# Altium schematic sheet Li-ion_charger.SchDoc: Li-ion battery charger.
size 297 x 209 mm; Author: Dmitry Shpakov; Organization: NoName; Revision: Revision; SheetNumber: 5; SheetTotal: 5; PageSize: A4; ProjectName: Project Name
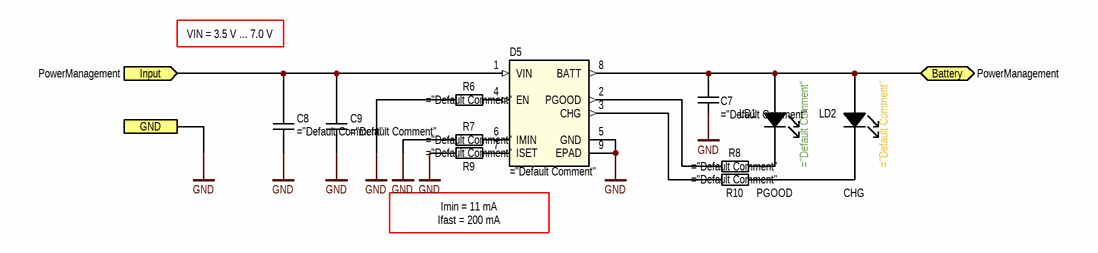
[diagram p0: Li-ion_charger.SchDoc]

## Parts
C7  (no value)
C8  (no value)
C9  (no value)
D5  (no value)
LD1  (no value)
LD2  (no value)
R6  (no value)
R7  (no value)
R8  (no value)
R9  (no value)
R10  (no value)

## Ports
Battery (bidir, see PowerManagement), GND (see PowerManagement, Buck_boost_converter, PowerManagement), Input (in, see PowerManagement)

## Nets
GND: C7.1 C8.2 C9.1 D5.5(GND) D5.9(EPAD) R6.1 R7.2 R9.1 ; port GND
Battery: C7.2 D5.8(BATT) LD1.C LD2.C ; port Battery
Input: C8.1 C9.2 D5.1(VIN) ; port Input
NetD5_2: D5.2(PGOOD) R8.1
NetD5_3: D5.3(CHG) R10.1
NetD5_4: D5.4(EN) R6.2
NetD5_6: D5.6(IMIN) R7.1
NetD5_7: D5.7(ISET) R9.2
NetLD1_A: LD1.A R8.2
NetLD2_A: LD2.A R10.2

## Notes on the sheet
- VIN = 3.5 V ... 7.0 V
- Imin = 11 mA
  Ifast = 200 mA
- PGOOD
- CHG
- Author
- Date
- Organization
- Page
- Total pages
- Materials
- Page size

## Library data of the parts
C7 C9 = CC0805KKX5R6BB105: CAP CER 1UF 10V X5R 0805; Manufacturer: YAGEO; Type: capacitor; Power Dissipation: * W; Rated Current: * A; Tolerance: 10 %; Other: 1 µF ±10% 10V Ceramic Capacitor X5R 0805 (2012 Metric); Operating Temperature: -55 °C to +85 °C; HelpURL: https://www.digikey.com/en/products/detail/yageo/CC0805KKX5R6BB105/2345239; Default Comment: 1 uF; Rated Voltage: 10 V; Rated Power: * W; Value: 1 uF; Summary: ="Type"+" "+"Part Number"+" "+"Manufacturer"+" "+"Value"+" "+"Tolerance"+" "+"Operating Temperature"+" "+"Case"+" "+"Power Dissipation"+" "+"Rated Current"+" "+"Rated Power"+" "+"Rated Voltage"+" "+"Other"; Assembly: *; Case: 0805; Part Number: CC0805KKX5R6BB105
C8 = CC0805KPX5R6BB106: CAP CER 10UF 10V X5R 0805; Manufacturer: YAGEO; Type: capacitor; Power Dissipation: * W; Rated Current: * A; Tolerance: 10 %; Other: 10 µF ±10% 10V Ceramic Capacitor X5R 0805 (2012 Metric); Operating Temperature: -55 °C to +85 °C; HelpURL: https://www.digikey.com/en/products/detail/yageo/CC0805KPX5R6BB106/11611309; Default Comment: 10 uF; Rated Voltage: 10 V; Rated Power: * W; Value: 10 uF; Summary: ="Type"+" "+"Part Number"+" "+"Manufacturer"+" "+"Value"+" "+"Tolerance"+" "+"Operating Temperature"+" "+"Case"+" "+"Power Dissipation"+" "+"Rated Current"+" "+"Rated Power"+" "+"Rated Voltage"+" "+"Other"; Assembly: *; Case: 0805; Part Number: CC0805KPX5R6BB106
D5 = RT9526AGQW: IC LI-ION BATT CHGR WDFN-8; Manufacturer: Richtek USA Inc.; Power Dissipation: * W; Rated Voltage: 28 V; Rated Current: * A; Tolerance: * %; Other: Charger IC Lithium Ion 8-WDFN (2x3); Operating Temperature: -40 °C to +85 °C; Type: ic; HelpURL: https://www.digikey.com/en/products/detail/richtek-usa-inc/RT9526AGQW/16376728; Default Comment: RT9526AGQW; Rated Power: * W; Value: *; Summary: ="Type"+" "+"Part Number"+" "+"Manufacturer"+" "+"Value"+" "+"Tolerance"+" "+"Operating Temperature"+" "+"Case"+" "+"Power Dissipation"+" "+"Rated Current"+" "+"Rated Power"+" "+"Rated Voltage"+" "+"Other"; Assembly: *; Case: 8-WDFN (2x3); Part Number: RT9526AGQW
LD1 = LTST-C191KGKT: LED GREEN CLEAR SMD; Manufacturer: Lite-On Inc.; Power Dissipation: * W; Tolerance: * %; Other: Green 571nm LED Indication - Discrete 2V 0603 (1608 Metric); Rated Voltage: 2 V; Rated Current: 20 mA; Operating Temperature: -55 °C to +85 °C; Type: led; HelpURL: https://www.digikey.com/en/products/detail/liteon/LTST-C191KGKT/386835; Default Comment: green; Rated Power: * W; Summary: ="Type"+" "+"Part Number"+" "+"Manufacturer"+" "+"Value"+" "+"Tolerance"+" "+"Operating Temperature"+" "+"Case"+" "+"Power Dissipation"+" "+"Rated Current"+" "+"Rated Power"+" "+"Rated Voltage"+" "+"Other"; Assembly: *; Case: 0603; Part Number: LTST-C191KGKT; Value: green
LD2 = LTST-C191KSKT: LED YELLOW CLEAR SMD; Manufacturer: Lite-On Inc.; Power Dissipation: * W; Tolerance: * %; Other: Yellow 591nm LED Indication - Discrete 2.1V 0603 (1608 Metric); Rated Voltage: 2.1 V; Rated Current: 20 mA; Operating Temperature: -55 °C to +85 °C; Type: led; HelpURL: https://www.digikey.com/en/products/detail/liteon/LTST-C191KSKT/386839; Default Comment: yellow; Rated Power: * W; Summary: ="Type"+" "+"Part Number"+" "+"Manufacturer"+" "+"Value"+" "+"Tolerance"+" "+"Operating Temperature"+" "+"Case"+" "+"Power Dissipation"+" "+"Rated Current"+" "+"Rated Power"+" "+"Rated Voltage"+" "+"Other"; Assembly: *; Case: 0603; Part Number: LTST-C191KSKT; Value: yellow
R6 = RC0603FR-07200KL: RES 200K OHM 1% 1/10W 0603; Manufacturer: YAGEO; Power Dissipation: 0.1 W; Rated Voltage: * V; Rated Current: * A; Other: 200 kOhms ±1% 0.1W, 1/10W Chip Resistor 0603 (1608 Metric) Moisture Resistant Thick Film; Operating Temperature: -55 °C to +155 °C; Type: resistor; HelpURL: https://www.digikey.com/en/products/detail/yageo/RC0603FR-07200KL/727044; Default Comment: 200k; Rated Power: 0.1 W; Tolerance: 1 %; Value: 200k; Summary: ="Type"+" "+"Part Number"+" "+"Manufacturer"+" "+"Value"+" "+"Tolerance"+" "+"Operating Temperature"+" "+"Case"+" "+"Power Dissipation"+" "+"Rated Current"+" "+"Rated Power"+" "+"Rated Voltage"+" "+"Other"; Assembly: *; Case: 0603; Part Number: RC0603FR-07200KL
R7 = RC0603FR-071ML: RES 1M OHM 1% 1/10W 0603; Manufacturer: YAGEO; Power Dissipation: 0.1 W; Rated Voltage: * V; Rated Current: * A; Other: 1 MOhms ±1% 0.1W, 1/10W Chip Resistor 0603 (1608 Metric) Moisture Resistant Thick Film; Operating Temperature: -55 °C to +155 °C; Type: resistor; HelpURL: https://www.digikey.com/en/products/detail/yageo/RC0603FR-071ML/726844; Default Comment: 1M; Rated Power: 0.1 W; Tolerance: 1 %; Value: 1M; Summary: ="Type"+" "+"Part Number"+" "+"Manufacturer"+" "+"Value"+" "+"Tolerance"+" "+"Operating Temperature"+" "+"Case"+" "+"Power Dissipation"+" "+"Rated Current"+" "+"Rated Power"+" "+"Rated Voltage"+" "+"Other"; Assembly: *; Case: 0603; Part Number: RC0603FR-071ML
R8 R10 = RC0603FR-07270RL: RES 270 OHM 1% 1/10W 0603; Manufacturer: YAGEO; Default Comment: 270R; Power Dissipation: 0.1 W; Rated Voltage: * V; Rated Current: * A; Value: 270R; Other: 270 Ohms ±1% 0.1W, 1/10W Chip Resistor 0603 (1608 Metric) Moisture Resistant Thick Film; Operating Temperature: -55 °C to +155 °C; Type: resistor; HelpURL: https://www.digikey.com/en/products/detail/yageo/RC0603FR-07270RL/727103; Rated Power: 0.1 W; Tolerance: 1 %; Summary: ="Type"+" "+"Part Number"+" "+"Manufacturer"+" "+"Value"+" "+"Tolerance"+" "+"Operating Temperature"+" "+"Case"+" "+"Power Dissipation"+" "+"Rated Current"+" "+"Rated Power"+" "+"Rated Voltage"+" "+"Other"; Assembly: *; Case: 0603; Part Number: RC0603FR-07270RL
R9 = RC0603FR-0762KL: RES 62K OHM 1% 1/10W 0603; Manufacturer: YAGEO; Power Dissipation: 0.1 W; Rated Voltage: * V; Rated Current: * A; Other: 62 kOhms ±1% 0.1W, 1/10W Chip Resistor 0603 (1608 Metric) Moisture Resistant Thick Film; Operating Temperature: -55 °C to +155 °C; Type: resistor; HelpURL: https://www.digikey.com/en/products/detail/yageo/RC0603FR-0762KL/727336; Default Comment: 62k; Rated Power: 0.1 W; Tolerance: 1 %; Value: 62k; Summary: ="Type"+" "+"Part Number"+" "+"Manufacturer"+" "+"Value"+" "+"Tolerance"+" "+"Operating Temperature"+" "+"Case"+" "+"Power Dissipation"+" "+"Rated Current"+" "+"Rated Power"+" "+"Rated Voltage"+" "+"Other"; Assembly: *; Case: 0603; Part Number: RC0603FR-0762KL